# EAGLE board BEP32_12nutzen_90Grad (EAGLE 6.4), part 1 of 8
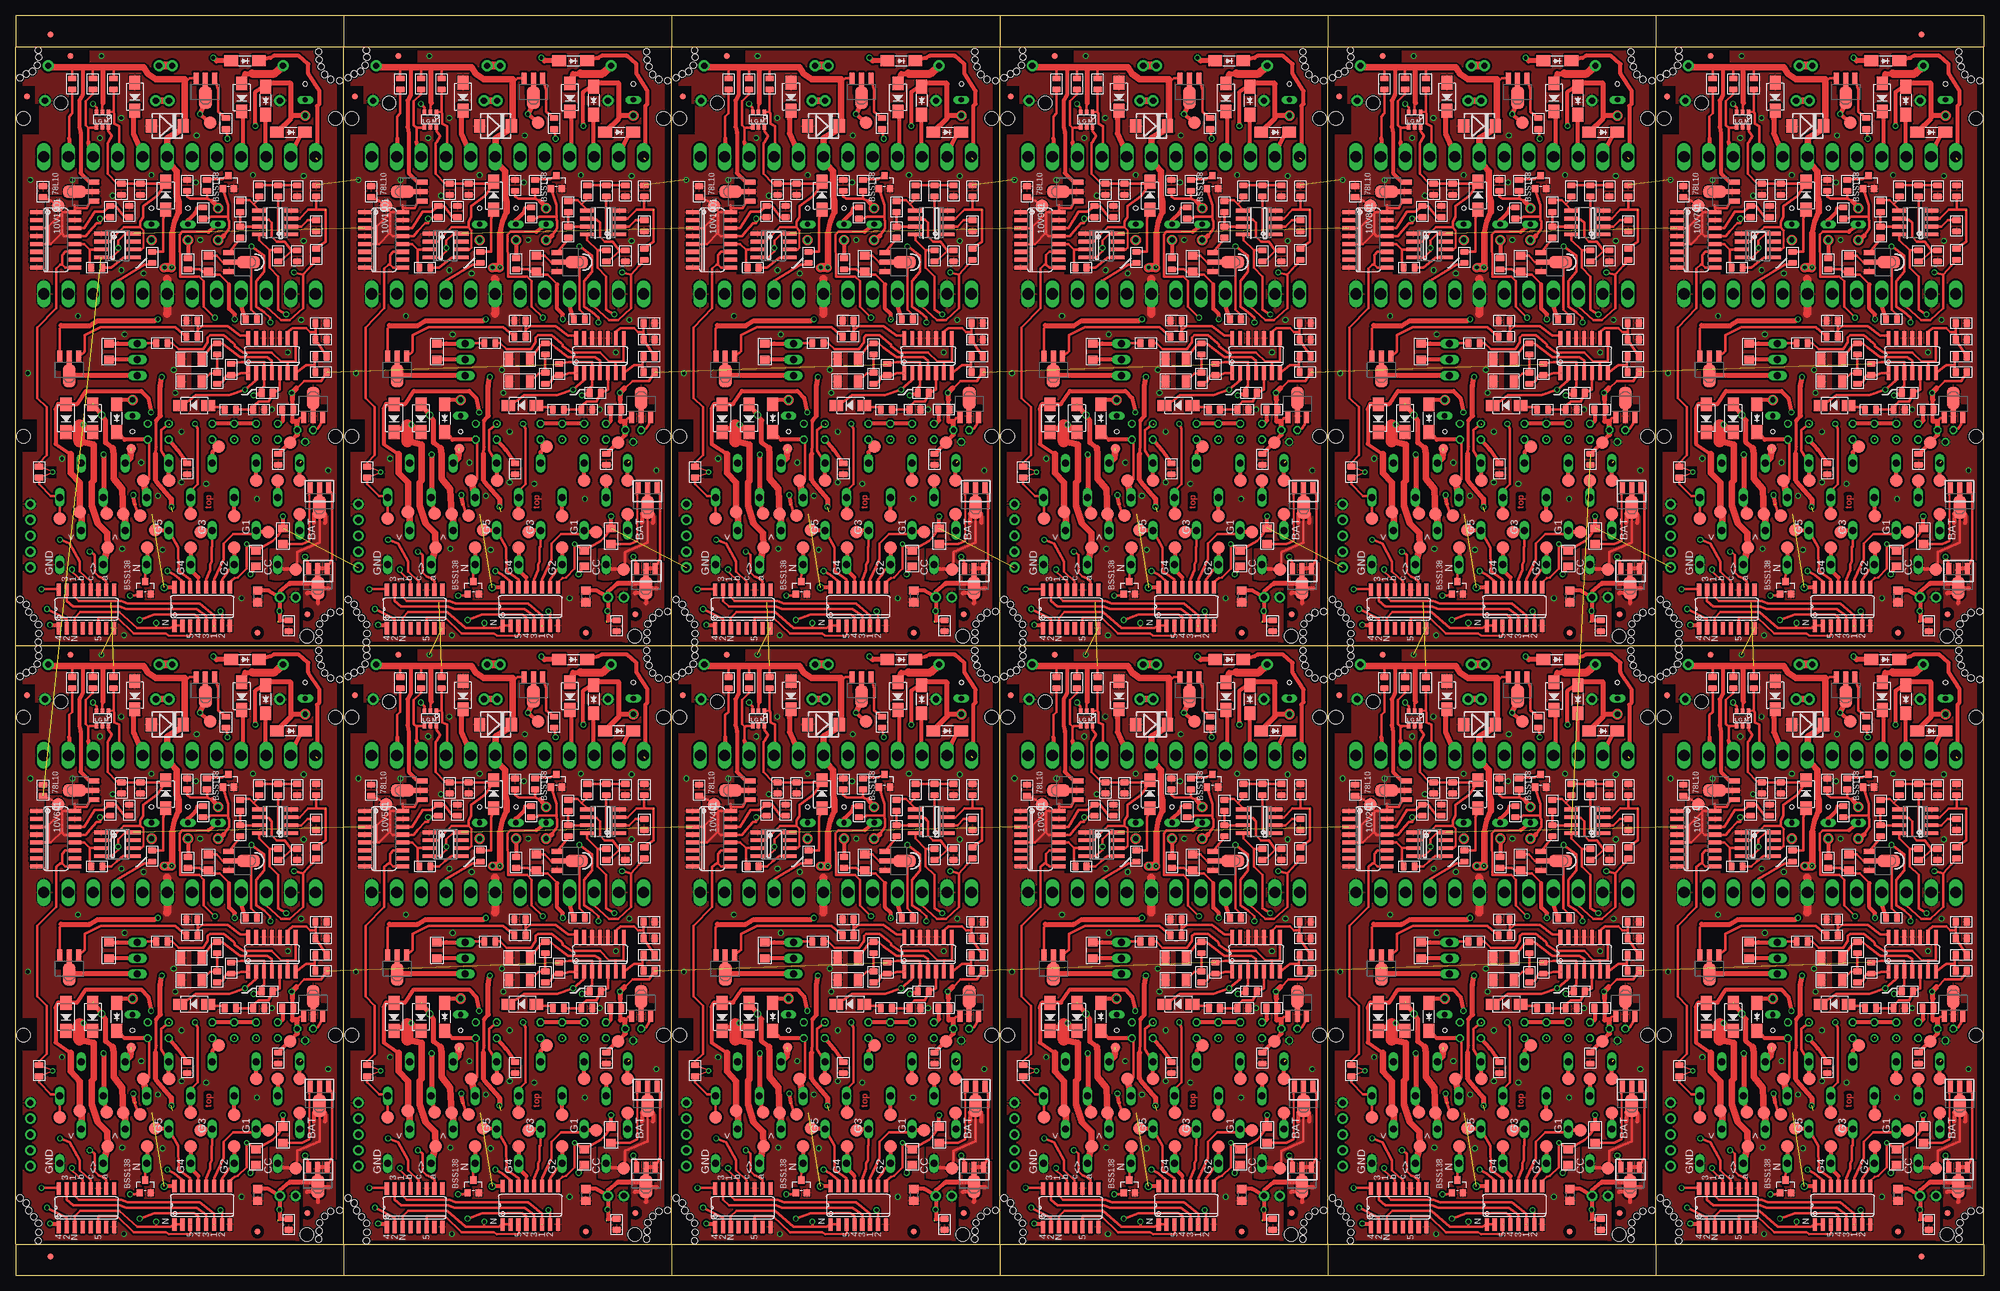
[diagram p24: board, top side]
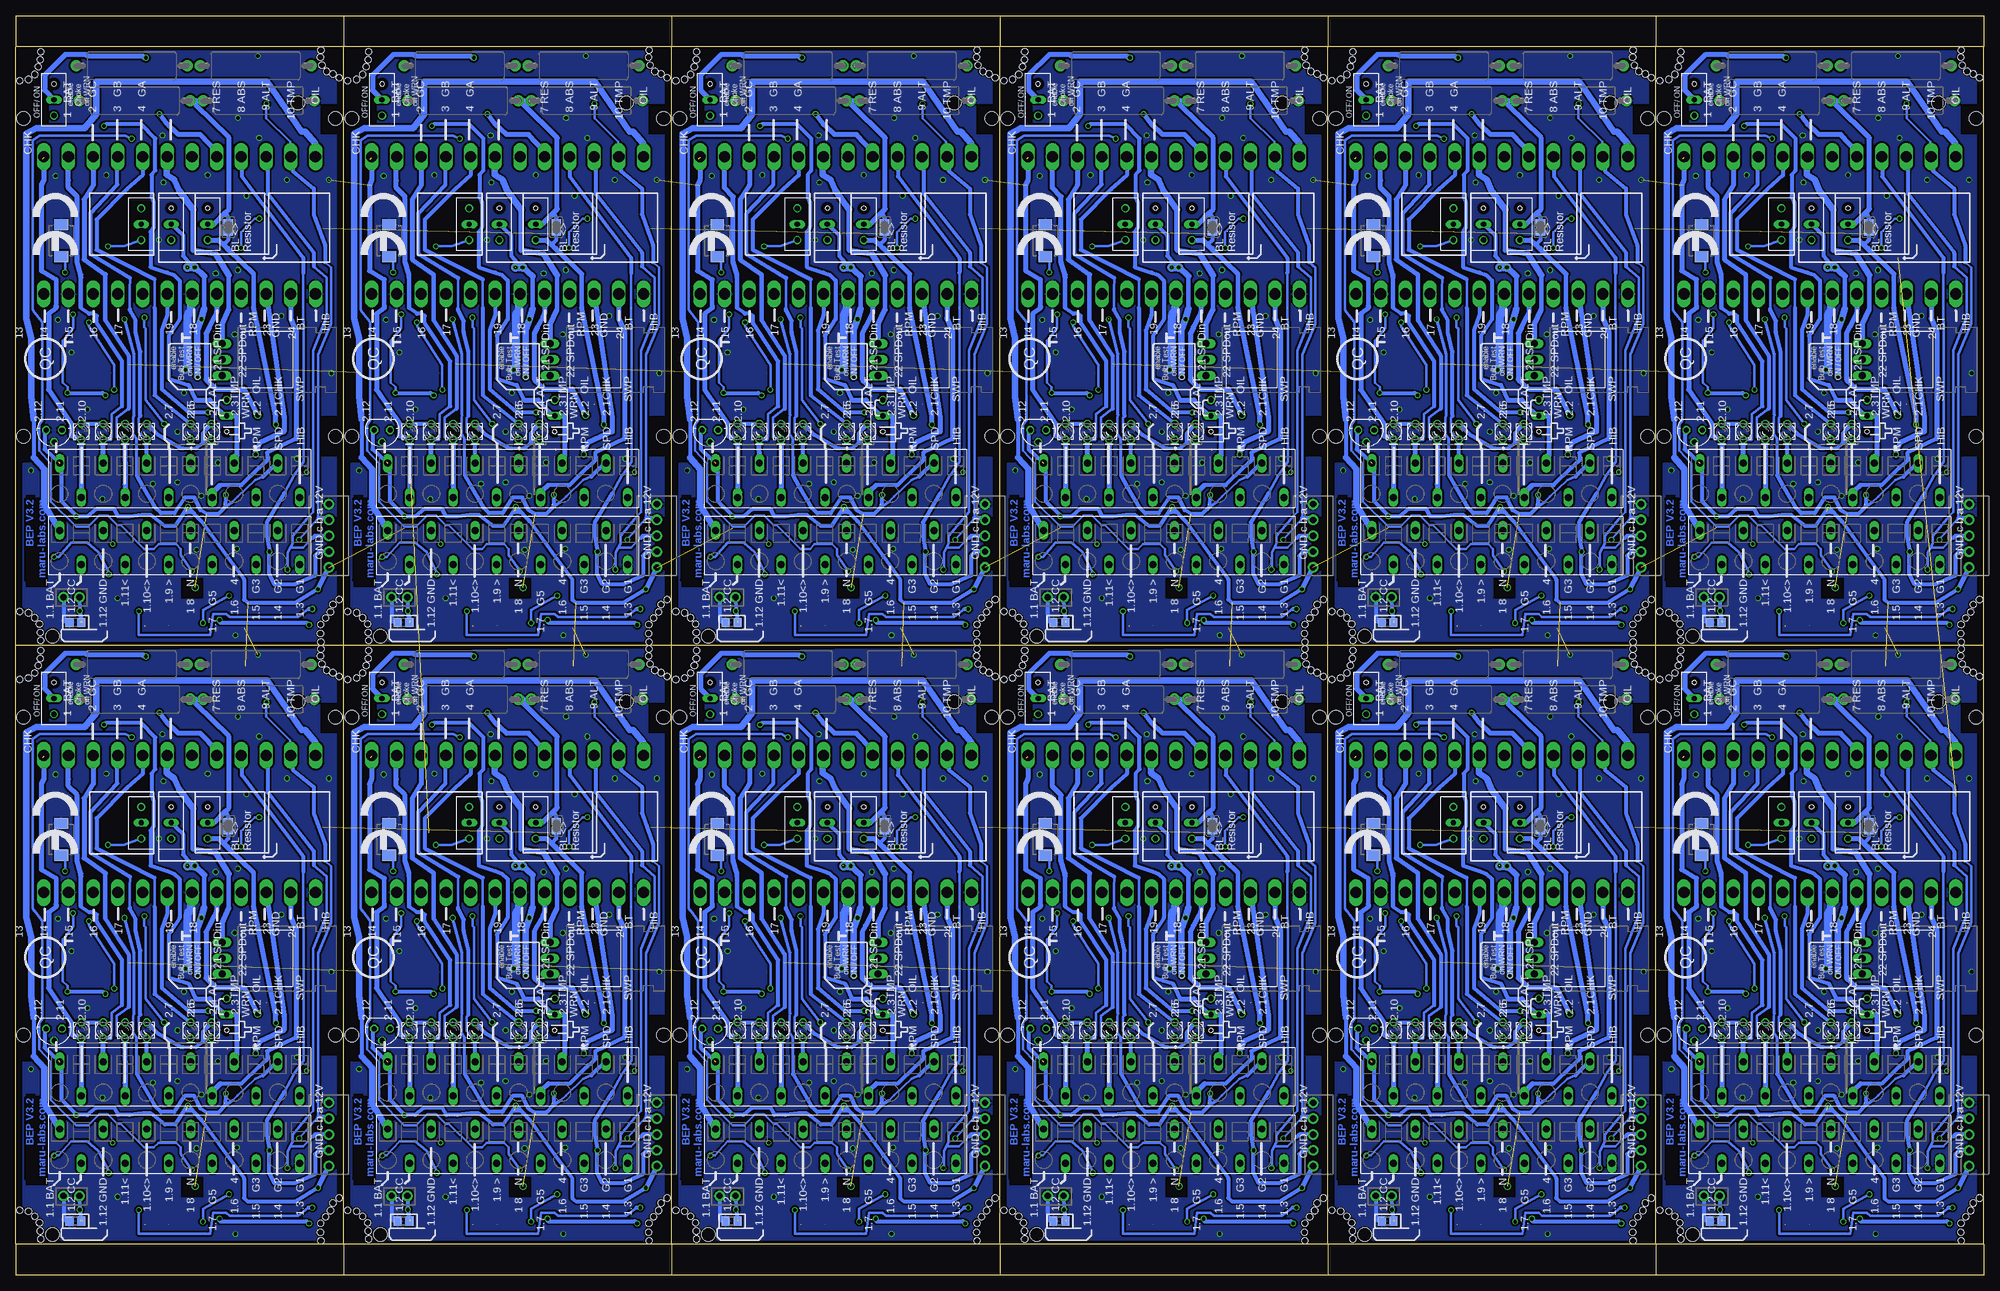
[diagram p25: board, bottom side, seen from below]

Size 315.6 x 202 mm. Coordinates in mm from the lower left corner, seen from the top.
Outline: 58 segments
Copper layers (1*16): Top 0.035mm / dielectric 1.5mm / Bottom 0.035mm
Design rules "multi-cb_035um-cu *": minimum track width 6mil, minimum drill 12mil, track to track 12mil, track to pad 12mil, pad to pad 6mil, via to via 6mil, smd to smd 6mil, copper to edge 10mil, drill to drill 8mil, minimum pad ring 8mil, minimum via ring 6mil, stop-mask expansion 3mil, vias tented up to drill 0mil, thermal gap 8mil
Holes 1.02 mm at 311.59,5.81 311.66,7.08 311.77,8.43 312.55,9.43 313.53,10.24 266.64,100.45 266.73,99.31 266.47,98.04 265.71,97.03 311.59,100.19 311.66,98.92 311.97,97.77 312.55,96.57 313.53,95.76 266.64,5.55 266.73,6.89 266.67,8.36 265.91,9.37 264.71,96.63 263.71,96.03 265.11,10.37 264.71,11.57 263.71,12.37 314.93,10.44 314.93,95.56 258.99,5.81 259.06,7.08 259.17,8.43 259.95,9.43 260.93,10.24 214.04,100.45 214.13,99.31 213.87,98.04 213.11,97.03 258.99,100.19 259.06,98.92 259.37,97.77 259.95,96.57 260.93,95.76 214.04,5.55 214.13,6.89 214.07,8.36 213.31,9.37 212.11,96.63 211.11,96.03 212.51,10.37 212.11,11.57 211.11,12.37 262.33,10.44 262.33,95.56 206.39,5.81 206.46,7.08 206.57,8.43 207.35,9.43 208.33,10.24 161.44,100.45 161.53,99.31 161.27,98.04 160.51,97.03 206.39,100.19 206.46,98.92 206.77,97.77 207.35,96.57 208.33,95.76 161.44,5.55 161.53,6.89 161.47,8.36 160.71,9.37 159.51,96.63 158.51,96.03 159.91,10.37 159.51,11.57 158.51,12.37 209.73,10.44 209.73,95.56 153.79,5.81 153.86,7.08 153.97,8.43 154.75,9.43 155.73,10.24 108.84,100.45 108.93,99.31 108.67,98.04 107.91,97.03 153.79,100.19 153.86,98.92 154.17,97.77 154.75,96.57 155.73,95.76 108.84,5.55 108.93,6.89 108.87,8.36 108.11,9.37 106.91,96.63 105.91,96.03 107.31,10.37 106.91,11.57 105.91,12.37 157.13,10.44 157.13,95.56 101.19,5.81 101.26,7.08 101.37,8.43 102.15,9.43 103.13,10.24 56.24,100.45 56.33,99.31 56.07,98.04 55.31,97.03 101.19,100.19 101.26,98.92 101.57,97.77 102.15,96.57 103.13,95.76 56.24,5.55 56.33,6.89 56.27,8.36 55.51,9.37 54.31,96.63 53.31,96.03 54.71,10.37 54.31,11.57 53.31,12.37 104.53,10.44 104.53,95.56 48.59,5.81 48.66,7.08 48.77,8.43 49.55,9.43 50.53,10.24 3.64,100.45 3.73,99.31 3.47,98.04 2.71,97.03 48.59,100.19 48.66,98.92 48.97,97.77 49.55,96.57 50.53,95.76 3.64,5.55 3.73,6.89 3.67,8.36 2.91,9.37 1.71,96.63 0.71,96.03 2.11,10.37 1.71,11.57 0.71,12.37 51.93,10.44 51.93,95.56 311.59,101.81 311.66,103.08 311.77,104.43 312.55,105.43 313.53,106.24 266.64,196.45 266.73,195.31 266.47,194.04 265.71,193.03 311.59,196.19 311.66,194.92 311.97,193.77 312.55,192.57 313.53,191.76 266.64,101.55 266.73,102.89 266.67,104.36 265.91,105.37 264.71,192.63 263.71,192.03 265.11,106.37 264.71,107.57 263.71,108.37 314.93,106.44 314.93,191.56 258.99,101.81 259.06,103.08 259.17,104.43 259.95,105.43 260.93,106.24 214.04,196.45 214.13,195.31 213.87,194.04 213.11,193.03 258.99,196.19 259.06,194.92 259.37,193.77 259.95,192.57 260.93,191.76 214.04,101.55 214.13,102.89 214.07,104.36 213.31,105.37 212.11,192.63 211.11,192.03 212.51,106.37 212.11,107.57 211.11,108.37 262.33,106.44 262.33,191.56 206.39,101.81 206.46,103.08 206.57,104.43 207.35,105.43 208.33,106.24 161.44,196.45 161.53,195.31 161.27,194.04 160.51,193.03 206.39,196.19 206.46,194.92 206.77,193.77 207.35,192.57 208.33,191.76 161.44,101.55 161.53,102.89 161.47,104.36 160.71,105.37 159.51,192.63 158.51,192.03 159.91,106.37 159.51,107.57 158.51,108.37 209.73,106.44 209.73,191.56 153.79,101.81 153.86,103.08 153.97,104.43 154.75,105.43 155.73,106.24 108.84,196.45 108.93,195.31 108.67,194.04 107.91,193.03 153.79,196.19 153.86,194.92 154.17,193.77 154.75,192.57 155.73,191.76 108.84,101.55 108.93,102.89 108.87,104.36 108.11,105.37 106.91,192.63 105.91,192.03 107.31,106.37 106.91,107.57 105.91,108.37 157.13,106.44 157.13,191.56 101.19,101.81 101.26,103.08 101.37,104.43 102.15,105.43 103.13,106.24 56.24,196.45 56.33,195.31 56.07,194.04 55.31,193.03 101.19,196.19 101.26,194.92 101.57,193.77 102.15,192.57 103.13,191.76 56.24,101.55 56.33,102.89 56.27,104.36 55.51,105.37 54.31,192.63 53.31,192.03 54.71,106.37 54.31,107.57 53.31,108.37 104.53,106.44 104.53,191.56 48.59,101.81 48.66,103.08 48.77,104.43 49.55,105.43 50.53,106.24 3.64,196.45 3.73,195.31 3.47,194.04 2.71,193.03 48.59,196.19 48.66,194.92 48.97,193.77 49.55,192.57 50.53,191.76 3.64,101.55 3.73,102.89 3.67,104.36 2.91,105.37 1.71,192.63 0.71,192.03 2.11,106.37 1.71,107.57 0.71,108.37 51.93,106.44 51.93,191.56
Holes 2.18 mm at 309.7,6.5 270.3,92 257.1,6.5 217.7,92 204.5,6.5 165.1,92 151.9,6.5 112.5,92 99.3,6.5 59.9,92 46.7,6.5 7.3,92 309.7,102.5 270.3,188 257.1,102.5 217.7,188 204.5,102.5 165.1,188 151.9,102.5 112.5,188 99.3,102.5 59.9,188 46.7,102.5 7.3,188
Holes 2.2 mm at 314.3,89.5 314.3,38.5 264.3,38.5 264.3,89.5 261.7,89.5 261.7,38.5 211.7,38.5 211.7,89.5 209.1,89.5 209.1,38.5 159.1,38.5 159.1,89.5 156.5,89.5 156.5,38.5 106.5,38.5 106.5,89.5 103.9,89.5 103.9,38.5 53.9,38.5 53.9,89.5 51.3,89.5 51.3,38.5 1.3,38.5 1.3,89.5 314.3,185.5 314.3,134.5 264.3,134.5 264.3,185.5 261.7,185.5 261.7,134.5 211.7,134.5 211.7,185.5 209.1,185.5 209.1,134.5 159.1,134.5 159.1,185.5 156.5,185.5 156.5,134.5 106.5,134.5 106.5,185.5 103.9,185.5 103.9,134.5 53.9,134.5 53.9,185.5 51.3,185.5 51.3,134.5 1.3,134.5 1.3,185.5
tRestrict: area 291.3,46 to 294.6,52.5; area 268.3,31.8 to 269.6,33.7; area 297,63.4 to 299,65.2; area 269.4,49.1 to 273.7,50.5; area 308.4,42.3 to 312.9,43.6; area 308.5,43.6 to 309.7,46.3; area 309.7,15 to 313.2,16.4; area 273.1,75.3 to 274.4,80; area 292,93.4 to 293.2,95; area 277.4,86.1 to 277.6,87.2; area 272.6,98.5 to 274.8,100.4; area 263.4,91.4 to 266.1,94.7; 168 more areas
bRestrict: area 310.4,14.4 to 314,24.6; area 312.5,24.5 to 314,29.1; area 312.5,34.3 to 314.7,40.8; area 264.1,35.3 to 266.5,41.8; area 310.3,86.6 to 314.1,92.6; area 285.5,12.5 to 289.1,15.8; area 263.7,87 to 266.7,91.8; area 257.8,14.4 to 261.4,24.6; area 259.9,24.5 to 261.4,29.1; area 259.9,34.3 to 262.1,40.8; area 211.5,35.3 to 213.9,41.8; area 257.7,86.6 to 261.5,92.6; 72 more areas

## Footprints (pad centres in the part's own frame; a part is rotated, then mirrored left to right if it is on the bottom)
12-PIN = drill 1.118 long: 1 19.25,-2.45; 2 15.75,3.05; 3 12.25,-2.45; 4 8.75,3.05; 5 5.25,-2.45; 6 1.75,3.05; 7 -1.75,-2.45; 8 -5.25,3.05; 9 -8.75,-2.45; 10 -12.25,3.05; 11 -15.75,-2.45; 12 -19.25,3.05
B2.0 = smd 2 x 2: TP 0,0
C0805 = smd 1.397 x 1.016: 1 0,0.889; 2 0,-0.889
C1206 = smd 1.27 x 2.032: 1 -1.651,0; 2 1.651,0
DO214AA = smd 1.8 x 2.2: A 2.55,0; C -2.55,0
DO-214AC = smd 2.2 x 1.77: 1 -2.242,0; 2 2.242,0
DO214AA_BI = smd 1.8 x 2.2: A 2.45,0; C -2.65,0
DO-214AC_SLIM = smd 2.2 x 1.77: 1 -2.242,0; 2 2.242,0
FIDUCIAL_1MM = smd 1 x 1: 1 0,0
SO08 = smd 0.6 x 2.2: 1 -1.905,-2.6; 2 -0.635,-2.6; 3 0.635,-2.6; 4 1.905,-2.6; 5 1.905,2.6; 6 0.635,2.6; 7 -0.635,2.6; 8 -1.905,2.6
SOT89_ROUND = smd 0.8 x 1.8: 1 -1.499,-2.181; 3 1.499,-2.181 | smd 0.8 x 2.3: 2 0,-1.927 | smd 2.032 x 3.65: 2@1 0,0.94
78LXX = drill 0.813 octagon: GND 0,1.905; IN 1.27,0; OUT -1.27,0
SO16 = smd 0.66 x 2.032: 1 -4.445,-3.073; 2 -3.175,-3.073; 3 -1.905,-3.073; 4 -0.635,-3.073; 5 0.635,-3.073; 6 1.905,-3.073; 7 3.175,-3.073; 8 4.445,-3.073; 9 4.445,3.073; 10 3.175,3.073; 11 1.905,3.073; 12 0.635,3.073; 13 -0.635,3.073; 14 -1.905,3.073; 15 -3.175,3.073; 16 -4.445,3.073
SOT457R_PHILIPS = smd 0.55 x 0.8: 1 -0.95,-1.2; 2 0,-1.2; 3 0.95,-1.2; 4 0.95,1.2; 5 0,1.2; 6 -0.95,1.2
SO14 = smd 0.6 x 2.2: 1 -3.81,-2.8; 2 -2.54,-2.8; 3 -1.27,-2.8; 4 0,-2.8; 5 1.27,-2.8; 6 2.54,-2.8; 7 3.81,-2.8; 8 3.81,2.8; 9 2.54,2.8; 10 1.27,2.8; 11 0,2.8; 12 -1.27,2.8; 13 -2.54,2.8; 14 -3.81,2.8
TO220H_NOHOLE = drill 1.118 long: 1 -2.54,-10.16; 2 0,-10.16; 3 2.54,-10.16
JP2_SMALLPADS = drill 0.85: 1 -2.54,0 | drill 0.85 long: 2 0,0 | hole 0.7: 2.54,0
JP2_ORIG_SMALLPADS = drill 0.85: 1 -2.54,0; 3 2.54,0 | drill 0.85 long: 2 0,0
LD260 = drill 0.813 octagon: A -1.27,0; K 1.27,0
SOT89 = smd 0.8 x 1.8: 1 -1.499,-2.181; 3 1.499,-2.181 | smd 0.8 x 2.3: 2 0,-1.927 | smd 2.032 x 3.65: 2@1 0,0.94
SOT-23 = smd 1.016 x 1.143: 1 -0.889,-1.016; 2 0.889,-1.016; 3 0,1.016
R0805 = smd 1.397 x 1.016: 1 0,0.889; 2 0,-0.889
R1206 = smd 1.27 x 1.524: 1 -1.27,0; 2 1.27,0
R0805' = smd 1.3 x 1.5: 1 -0.95,0; 2 0.95,0
V235/17_1MM = drill 1 pad 1.778: 1 -8.89,0; 2 8.89,0
SJ = smd 1.2 x 1.6: 1 -0.725,0; 2 0.725,0
B1,27 = smd 1.5 x 1.5: TP 0,0
24-PIN_V2 = drill 1.778 long: 1 -21.78,-11; 2 -17.82,-11; 3 -13.86,-11; 4 -9.9,-11; 5 -5.94,-11; 6 -1.98,-11; 7 1.98,-11; 8 5.94,-11; 9 9.9,-11; 10 13.86,-11; 11 17.82,-11; 12 21.78,-11; 13 -21.78,11; 14 -17.82,11; 15 -13.86,11; 16 -9.9,11; 17 -5.94,11; 18 -1.98,11; 19 1.98,11; 20 5.94,11; 21 9.9,11; 22 13.86,11; 23 17.82,11; 24 21.78,11
22-23-2021 = drill 1 pad 1.676: 1 -1.27,0; 2 1.27,0
22-23-2051 = drill 1 pad 1.676: 1 -5.08,0; 2 -2.54,0; 3 0,0; 4 2.54,0; 5 5.08,0

## Placement (x,y rotation side)
1  [12-PIN]  289.3,20.99 180 bottom
2  [12-PIN]  289.3,31.79 180 bottom
3  [12-PIN]  236.7,20.99 180 bottom
4  [12-PIN]  236.7,31.79 180 bottom
5  [12-PIN]  184.1,20.99 180 bottom
6  [12-PIN]  184.1,31.79 180 bottom
6V  TPSB2.0  [B2.0]  307.02,37.5 90 top
6V201  TPSB2.0  [B2.0]  254.42,37.5 90 top
6V301  TPSB2.0  [B2.0]  201.82,37.5 90 top
6V401  TPSB2.0  [B2.0]  149.22,37.5 90 top
6V501  TPSB2.0  [B2.0]  96.62,37.5 90 top
6V601  TPSB2.0  [B2.0]  44.02,37.5 90 top
6V701  TPSB2.0  [B2.0]  307.02,133.5 90 top
6V801  TPSB2.0  [B2.0]  254.42,133.5 90 top
6V901  TPSB2.0  [B2.0]  201.82,133.5 90 top
6V1001  TPSB2.0  [B2.0]  149.22,133.5 90 top
6V1101  TPSB2.0  [B2.0]  96.62,133.5 90 top
6V1201  TPSB2.0  [B2.0]  44.02,133.5 90 top
7  [12-PIN]  131.5,20.99 180 bottom
8  [12-PIN]  131.5,31.79 180 bottom
9  [12-PIN]  78.9,20.99 180 bottom
10  [12-PIN]  78.9,31.79 180 bottom
10V  TPSB2.0  [B2.0]  269.8,75.5 90 top
10V201  TPSB2.0  [B2.0]  217.2,75.5 90 top
10V301  TPSB2.0  [B2.0]  164.6,75.5 90 top
10V401  TPSB2.0  [B2.0]  112,75.5 90 top
10V501  TPSB2.0  [B2.0]  59.4,75.5 90 top
10V601  TPSB2.0  [B2.0]  6.8,75.5 90 top
10V701  TPSB2.0  [B2.0]  269.8,171.5 90 top
10V801  TPSB2.0  [B2.0]  217.2,171.5 90 top
10V901  TPSB2.0  [B2.0]  164.6,171.5 90 top
10V1001  TPSB2.0  [B2.0]  112,171.5 90 top
10V1101  TPSB2.0  [B2.0]  59.4,171.5 90 top
10V1201  TPSB2.0  [B2.0]  6.8,171.5 90 top
11  [12-PIN]  26.3,20.99 180 bottom
12  [12-PIN]  26.3,31.79 180 bottom
13  [12-PIN]  289.3,116.99 180 bottom
14  [12-PIN]  289.3,127.78 180 bottom
15  [12-PIN]  236.7,116.99 180 bottom
16  [12-PIN]  236.7,127.78 180 bottom
17  [12-PIN]  184.1,116.99 180 bottom
18  [12-PIN]  184.1,127.78 180 bottom
19  [12-PIN]  131.5,116.99 180 bottom
20  [12-PIN]  131.5,127.78 180 bottom
21  [12-PIN]  78.9,116.99 180 bottom
22  [12-PIN]  78.9,127.78 180 bottom
23  [12-PIN]  26.3,116.99 180 bottom
24  [12-PIN]  26.3,127.78 180 bottom
C101  4.7u  [C0805]  311.21,77.89 180 top
C102  100nF  [C0805]  267.4,77.76 180 top
C103  100nF,  [C0805]  308.16,77.89 0 top
C104  100nF,  [C0805]  305.12,34.83 0 top
C105  100nF.  [C0805]  311.97,54.01 90 top
C106  100nF.  [C0805]  291.27,57.06 90 top
C107  100u  [C1206]  291.21,47.34 180 top
C108  100u  [C1206]  291.21,50.9 180 top
C109  2.2nF  [C0805]  283.02,78.14 180 top
C110  100nF  [C0805]  281.24,74.58 180 top
C201  4.7u  [C0805]  258.61,77.89 180 top
C202  100nF  [C0805]  214.8,77.76 180 top
C203  100nF,  [C0805]  255.56,77.89 0 top
C204  100nF,  [C0805]  252.52,34.83 0 top
C205  100nF.  [C0805]  259.37,54.01 90 top
C206  100nF.  [C0805]  238.67,57.06 90 top
C207  100u  [C1206]  238.61,47.34 180 top
C208  100u  [C1206]  238.61,50.9 180 top
C209  2.2nF  [C0805]  230.42,78.14 180 top
C210  100nF  [C0805]  228.64,74.58 180 top
C301  4.7u  [C0805]  206.01,77.89 180 top
C302  100nF  [C0805]  162.2,77.76 180 top
C303  100nF,  [C0805]  202.96,77.89 0 top
C304  100nF,  [C0805]  199.92,34.83 0 top
C305  100nF.  [C0805]  206.77,54.01 90 top
C306  100nF.  [C0805]  186.07,57.06 90 top
C307  100u  [C1206]  186.01,47.34 180 top
C308  100u  [C1206]  186.01,50.9 180 top
C309  2.2nF  [C0805]  177.82,78.14 180 top
C310  100nF  [C0805]  176.04,74.58 180 top
C401  4.7u  [C0805]  153.41,77.89 180 top
C402  100nF  [C0805]  109.6,77.76 180 top
C403  100nF,  [C0805]  150.36,77.89 0 top
C404  100nF,  [C0805]  147.32,34.83 0 top
C405  100nF.  [C0805]  154.17,54.01 90 top
C406  100nF.  [C0805]  133.47,57.06 90 top
C407  100u  [C1206]  133.41,47.34 180 top
C408  100u  [C1206]  133.41,50.9 180 top
C409  2.2nF  [C0805]  125.22,78.14 180 top
C410  100nF  [C0805]  123.44,74.58 180 top
C501  4.7u  [C0805]  100.81,77.89 180 top
C502  100nF  [C0805]  57,77.76 180 top
C503  100nF,  [C0805]  97.76,77.89 0 top
C504  100nF,  [C0805]  94.72,34.83 0 top
C505  100nF.  [C0805]  101.57,54.01 90 top
C506  100nF.  [C0805]  80.87,57.06 90 top
C507  100u  [C1206]  80.81,47.34 180 top
C508  100u  [C1206]  80.81,50.9 180 top
C509  2.2nF  [C0805]  72.62,78.14 180 top
C510  100nF  [C0805]  70.84,74.58 180 top
C601  4.7u  [C0805]  48.21,77.89 180 top
C602  100nF  [C0805]  4.4,77.76 180 top
C603  100nF,  [C0805]  45.16,77.89 0 top
C604  100nF,  [C0805]  42.12,34.83 0 top
C605  100nF.  [C0805]  48.97,54.01 90 top
C606  100nF.  [C0805]  28.27,57.06 90 top
C607  100u  [C1206]  28.21,47.34 180 top
C608  100u  [C1206]  28.21,50.9 180 top
C609  2.2nF  [C0805]  20.02,78.14 180 top
C610  100nF  [C0805]  18.24,74.58 180 top
C701  4.7u  [C0805]  311.21,173.89 180 top
C702  100nF  [C0805]  267.4,173.76 180 top
C703  100nF,  [C0805]  308.16,173.89 0 top
C704  100nF,  [C0805]  305.12,130.83 0 top
C705  100nF.  [C0805]  311.97,150.01 90 top
C706  100nF.  [C0805]  291.27,153.06 90 top
C707  100u  [C1206]  291.21,143.34 180 top
C708  100u  [C1206]  291.21,146.9 180 top
C709  2.2nF  [C0805]  283.02,174.14 180 top
C710  100nF  [C0805]  281.24,170.58 180 top
C801  4.7u  [C0805]  258.61,173.89 180 top
C802  100nF  [C0805]  214.8,173.76 180 top
C803  100nF,  [C0805]  255.56,173.89 0 top
C804  100nF,  [C0805]  252.52,130.83 0 top
C805  100nF.  [C0805]  259.37,150.01 90 top
C806  100nF.  [C0805]  238.67,153.06 90 top
C807  100u  [C1206]  238.61,143.34 180 top
C808  100u  [C1206]  238.61,146.9 180 top
C809  2.2nF  [C0805]  230.42,174.14 180 top
C810  100nF  [C0805]  228.64,170.58 180 top
C901  4.7u  [C0805]  206.01,173.89 180 top
C902  100nF  [C0805]  162.2,173.76 180 top
C903  100nF,  [C0805]  202.96,173.89 0 top
C904  100nF,  [C0805]  199.92,130.83 0 top
C905  100nF.  [C0805]  206.77,150.01 90 top
C906  100nF.  [C0805]  186.07,153.06 90 top
C907  100u  [C1206]  186.01,143.34 180 top
C908  100u  [C1206]  186.01,146.9 180 top
C909  2.2nF  [C0805]  177.82,174.14 180 top
C910  100nF  [C0805]  176.04,170.58 180 top
C1001  4.7u  [C0805]  153.41,173.89 180 top
C1002  100nF  [C0805]  109.6,173.76 180 top
C1003  100nF,  [C0805]  150.36,173.89 0 top
C1004  100nF,  [C0805]  147.32,130.83 0 top
C1005  100nF.  [C0805]  154.17,150.01 90 top
C1006  100nF.  [C0805]  133.47,153.06 90 top
C1007  100u  [C1206]  133.41,143.34 180 top
C1008  100u  [C1206]  133.41,146.9 180 top
C1009  2.2nF  [C0805]  125.22,174.14 180 top
C1010  100nF  [C0805]  123.44,170.58 180 top
C1101  4.7u  [C0805]  100.81,173.89 180 top
C1102  100nF  [C0805]  57,173.76 180 top
C1103  100nF,  [C0805]  97.76,173.89 0 top
C1104  100nF,  [C0805]  94.72,130.83 0 top
C1105  100nF.  [C0805]  101.57,150.01 90 top
C1106  100nF.  [C0805]  80.87,153.06 90 top
C1107  100u  [C1206]  80.81,143.34 180 top
C1108  100u  [C1206]  80.81,146.9 180 top
C1109  2.2nF  [C0805]  72.62,174.14 180 top
C1110  100nF  [C0805]  70.84,170.58 180 top
C1201  4.7u  [C0805]  48.21,173.89 180 top
C1202  100nF  [C0805]  4.4,173.76 180 top
C1203  100nF,  [C0805]  45.16,173.89 0 top
C1204  100nF,  [C0805]  42.12,130.83 0 top
C1205  100nF.  [C0805]  48.97,150.01 90 top
C1206  100nF.  [C0805]  28.27,153.06 90 top
C1207  100u  [C1206]  28.21,143.34 180 top
C1208  100u  [C1206]  28.21,146.9 180 top
C1209  2.2nF  [C0805]  20.02,174.14 180 top
C1210  100nF  [C0805]  18.24,170.58 180 top
D101  SM6T  [DO214AA]  287.34,88.3 180 top
D102  1N4007,  [DO-214AC]  275.4,41.44 270 top
D103  1N4007,  [DO-214AC]  271.08,41.44 270 top
D104  SM6TDO214AA_BI  [DO214AA_BI]  308.29,70.01 90 bottom
D105  1N4007.  [DO-214AC]  282.13,93 270 top
D106  1N4007.  [DO-214AC]  299.27,92.87 270 top
D107  1N5817  [DO-214AC_SLIM]  303.08,92.36 270 top
D108  1N5817.  [DO-214AC_SLIM]  307.16,87.3 0 top
D109  1N5817.  [DO-214AC_SLIM]  299.79,98.73 0 top
D110  1N5817  [DO-214AC_SLIM]  279.21,41.44 270 top
D111  1N4007  [DO-214AC]  291.65,43.47 180 top
D112  1N4007  [DO-214AC]  287.08,77.12 90 top
D201  SM6T  [DO214AA]  234.74,88.3 180 top
D202  1N4007,  [DO-214AC]  222.8,41.44 270 top
D203  1N4007,  [DO-214AC]  218.48,41.44 270 top
D204  SM6TDO214AA_BI  [DO214AA_BI]  255.69,70.01 90 bottom
D205  1N4007.  [DO-214AC]  229.53,93 270 top
D206  1N4007.  [DO-214AC]  246.67,92.87 270 top
D207  1N5817  [DO-214AC_SLIM]  250.48,92.36 270 top
D208  1N5817.  [DO-214AC_SLIM]  254.56,87.3 0 top
D209  1N5817.  [DO-214AC_SLIM]  247.19,98.73 0 top
D210  1N5817  [DO-214AC_SLIM]  226.61,41.44 270 top
D211  1N4007  [DO-214AC]  239.05,43.47 180 top
D212  1N4007  [DO-214AC]  234.48,77.12 90 top
D301  SM6T  [DO214AA]  182.14,88.3 180 top
D302  1N4007,  [DO-214AC]  170.2,41.44 270 top
D303  1N4007,  [DO-214AC]  165.88,41.44 270 top
D304  SM6TDO214AA_BI  [DO214AA_BI]  203.09,70.01 90 bottom
D305  1N4007.  [DO-214AC]  176.93,93 270 top
D306  1N4007.  [DO-214AC]  194.07,92.87 270 top
D307  1N5817  [DO-214AC_SLIM]  197.88,92.36 270 top
D308  1N5817.  [DO-214AC_SLIM]  201.96,87.3 0 top
D309  1N5817.  [DO-214AC_SLIM]  194.59,98.73 0 top
D310  1N5817  [DO-214AC_SLIM]  174.01,41.44 270 top
D311  1N4007  [DO-214AC]  186.45,43.47 180 top
D312  1N4007  [DO-214AC]  181.88,77.12 90 top
D401  SM6T  [DO214AA]  129.54,88.3 180 top
D402  1N4007,  [DO-214AC]  117.6,41.44 270 top
D403  1N4007,  [DO-214AC]  113.28,41.44 270 top
D404  SM6TDO214AA_BI  [DO214AA_BI]  150.49,70.01 90 bottom
D405  1N4007.  [DO-214AC]  124.33,93 270 top
D406  1N4007.  [DO-214AC]  141.47,92.87 270 top
D407  1N5817  [DO-214AC_SLIM]  145.28,92.36 270 top
D408  1N5817.  [DO-214AC_SLIM]  149.36,87.3 0 top
D409  1N5817.  [DO-214AC_SLIM]  141.99,98.73 0 top
D410  1N5817  [DO-214AC_SLIM]  121.41,41.44 270 top
D411  1N4007  [DO-214AC]  133.85,43.47 180 top
D412  1N4007  [DO-214AC]  129.28,77.12 90 top
D501  SM6T  [DO214AA]  76.94,88.3 180 top
D502  1N4007,  [DO-214AC]  65,41.44 270 top
D503  1N4007,  [DO-214AC]  60.68,41.44 270 top
D504  SM6TDO214AA_BI  [DO214AA_BI]  97.89,70.01 90 bottom
D505  1N4007.  [DO-214AC]  71.73,93 270 top
D506  1N4007.  [DO-214AC]  88.87,92.87 270 top
D507  1N5817  [DO-214AC_SLIM]  92.68,92.36 270 top
D508  1N5817.  [DO-214AC_SLIM]  96.76,87.3 0 top
D509  1N5817.  [DO-214AC_SLIM]  89.39,98.73 0 top
D510  1N5817  [DO-214AC_SLIM]  68.81,41.44 270 top
D511  1N4007  [DO-214AC]  81.25,43.47 180 top
D512  1N4007  [DO-214AC]  76.68,77.12 90 top
D601  SM6T  [DO214AA]  24.34,88.3 180 top
D602  1N4007,  [DO-214AC]  12.4,41.44 270 top
D603  1N4007,  [DO-214AC]  8.08,41.44 270 top
D604  SM6TDO214AA_BI  [DO214AA_BI]  45.29,70.01 90 bottom
D605  1N4007.  [DO-214AC]  19.13,93 270 top
D606  1N4007.  [DO-214AC]  36.27,92.87 270 top
D607  1N5817  [DO-214AC_SLIM]  40.08,92.36 270 top
D608  1N5817.  [DO-214AC_SLIM]  44.16,87.3 0 top
D609  1N5817.  [DO-214AC_SLIM]  36.79,98.73 0 top
D610  1N5817  [DO-214AC_SLIM]  16.21,41.44 270 top
D611  1N4007  [DO-214AC]  28.65,43.47 180 top
D612  1N4007  [DO-214AC]  24.08,77.12 90 top
D701  SM6T  [DO214AA]  287.34,184.3 180 top
D702  1N4007,  [DO-214AC]  275.4,137.44 270 top
D703  1N4007,  [DO-214AC]  271.08,137.44 270 top
D704  SM6TDO214AA_BI  [DO214AA_BI]  308.29,166.01 90 bottom
D705  1N4007.  [DO-214AC]  282.13,189 270 top
D706  1N4007.  [DO-214AC]  299.27,188.87 270 top
D707  1N5817  [DO-214AC_SLIM]  303.08,188.36 270 top
D708  1N5817.  [DO-214AC_SLIM]  307.16,183.3 0 top
D709  1N5817.  [DO-214AC_SLIM]  299.79,194.73 0 top
D710  1N5817  [DO-214AC_SLIM]  279.21,137.44 270 top
D711  1N4007  [DO-214AC]  291.65,139.47 180 top
D712  1N4007  [DO-214AC]  287.08,173.12 90 top
D801  SM6T  [DO214AA]  234.74,184.3 180 top
D802  1N4007,  [DO-214AC]  222.8,137.44 270 top
D803  1N4007,  [DO-214AC]  218.48,137.44 270 top
D804  SM6TDO214AA_BI  [DO214AA_BI]  255.69,166.01 90 bottom
D805  1N4007.  [DO-214AC]  229.53,189 270 top
D806  1N4007.  [DO-214AC]  246.67,188.87 270 top
D807  1N5817  [DO-214AC_SLIM]  250.48,188.36 270 top
D808  1N5817.  [DO-214AC_SLIM]  254.56,183.3 0 top
D809  1N5817.  [DO-214AC_SLIM]  247.19,194.73 0 top
D810  1N5817  [DO-214AC_SLIM]  226.61,137.44 270 top
D811  1N4007  [DO-214AC]  239.05,139.47 180 top
D812  1N4007  [DO-214AC]  234.48,173.12 90 top
D901  SM6T  [DO214AA]  182.14,184.3 180 top
D902  1N4007,  [DO-214AC]  170.2,137.44 270 top
D903  1N4007,  [DO-214AC]  165.88,137.44 270 top
D904  SM6TDO214AA_BI  [DO214AA_BI]  203.09,166.01 90 bottom
D905  1N4007.  [DO-214AC]  176.93,189 270 top
D906  1N4007.  [DO-214AC]  194.07,188.87 270 top
D907  1N5817  [DO-214AC_SLIM]  197.88,188.36 270 top
D908  1N5817.  [DO-214AC_SLIM]  201.96,183.3 0 top
D909  1N5817.  [DO-214AC_SLIM]  194.59,194.73 0 top
D910  1N5817  [DO-214AC_SLIM]  174.01,137.44 270 top
D911  1N4007  [DO-214AC]  186.45,139.47 180 top
D912  1N4007  [DO-214AC]  181.88,173.12 90 top
D1001  SM6T  [DO214AA]  129.54,184.3 180 top
D1002  1N4007,  [DO-214AC]  117.6,137.44 270 top
D1003  1N4007,  [DO-214AC]  113.28,137.44 270 top
D1004  SM6TDO214AA_BI  [DO214AA_BI]  150.49,166.01 90 bottom
D1005  1N4007.  [DO-214AC]  124.33,189 270 top
D1006  1N4007.  [DO-214AC]  141.47,188.87 270 top
D1007  1N5817  [DO-214AC_SLIM]  145.28,188.36 270 top
D1008  1N5817.  [DO-214AC_SLIM]  149.36,183.3 0 top
D1009  1N5817.  [DO-214AC_SLIM]  141.99,194.73 0 top
D1010  1N5817  [DO-214AC_SLIM]  121.41,137.44 270 top
D1011  1N4007  [DO-214AC]  133.85,139.47 180 top
D1012  1N4007  [DO-214AC]  129.28,173.12 90 top
D1101  SM6T  [DO214AA]  76.94,184.3 180 top
D1102  1N4007,  [DO-214AC]  65,137.44 270 top
D1103  1N4007,  [DO-214AC]  60.68,137.44 270 top
D1104  SM6TDO214AA_BI  [DO214AA_BI]  97.89,166.01 90 bottom
D1105  1N4007.  [DO-214AC]  71.73,189 270 top
D1106  1N4007.  [DO-214AC]  88.87,188.87 270 top
D1107  1N5817  [DO-214AC_SLIM]  92.68,188.36 270 top
D1108  1N5817.  [DO-214AC_SLIM]  96.76,183.3 0 top
D1109  1N5817.  [DO-214AC_SLIM]  89.39,194.73 0 top
D1110  1N5817  [DO-214AC_SLIM]  68.81,137.44 270 top
D1111  1N4007  [DO-214AC]  81.25,139.47 180 top
D1112  1N4007  [DO-214AC]  76.68,173.12 90 top
D1201  SM6T  [DO214AA]  24.34,184.3 180 top
D1202  1N4007,  [DO-214AC]  12.4,137.44 270 top
D1203  1N4007,  [DO-214AC]  8.08,137.44 270 top
D1204  SM6TDO214AA_BI  [DO214AA_BI]  45.29,166.01 90 bottom
D1205  1N4007.  [DO-214AC]  19.13,189 270 top
D1206  1N4007.  [DO-214AC]  36.27,188.87 270 top
D1207  1N5817  [DO-214AC_SLIM]  40.08,188.36 270 top
D1208  1N5817.  [DO-214AC_SLIM]  44.16,183.3 0 top
D1209  1N5817.  [DO-214AC_SLIM]  36.79,194.73 0 top
D1210  1N5817  [DO-214AC_SLIM]  16.21,137.44 270 top
D1211  1N4007  [DO-214AC]  28.65,139.47 180 top
D1212  1N4007  [DO-214AC]  24.08,173.12 90 top
FID1  FIDUCIAL  [FIDUCIAL_1MM]  305.6,199 90 top
FID2  FIDUCIAL  [FIDUCIAL_1MM]  5.6,3 90 top
FID101  FIDUCIAL  [FIDUCIAL_1MM]  264.8,93 90 top
FID102  FIDUCIAL  [FIDUCIAL_1MM]  301.8,7 90 top
FID103  FIDUCIAL  [FIDUCIAL_1MM]  309.8,10 90 top
FID104  FIDUCIAL  [FIDUCIAL_1MM]  271.8,99.5 90 top
FID105  FIDUCIAL  [FIDUCIAL_1MM]  305.6,3 90 top
FID108  FIDUCIAL  [FIDUCIAL_1MM]  5.6,199 90 top
FID201  FIDUCIAL  [FIDUCIAL_1MM]  212.2,93 90 top
FID202  FIDUCIAL  [FIDUCIAL_1MM]  249.2,7 90 top
FID203  FIDUCIAL  [FIDUCIAL_1MM]  257.2,10 90 top
FID204  FIDUCIAL  [FIDUCIAL_1MM]  219.2,99.5 90 top
FID301  FIDUCIAL  [FIDUCIAL_1MM]  159.6,93 90 top
FID302  FIDUCIAL  [FIDUCIAL_1MM]  196.6,7 90 top
FID303  FIDUCIAL  [FIDUCIAL_1MM]  204.6,10 90 top
FID304  FIDUCIAL  [FIDUCIAL_1MM]  166.6,99.5 90 top
FID401  FIDUCIAL  [FIDUCIAL_1MM]  107,93 90 top
FID402  FIDUCIAL  [FIDUCIAL_1MM]  144,7 90 top
FID403  FIDUCIAL  [FIDUCIAL_1MM]  152,10 90 top
FID404  FIDUCIAL  [FIDUCIAL_1MM]  114,99.5 90 top
FID501  FIDUCIAL  [FIDUCIAL_1MM]  54.4,93 90 top
FID502  FIDUCIAL  [FIDUCIAL_1MM]  91.4,7 90 top
FID503  FIDUCIAL  [FIDUCIAL_1MM]  99.4,10 90 top
FID504  FIDUCIAL  [FIDUCIAL_1MM]  61.4,99.5 90 top
FID601  FIDUCIAL  [FIDUCIAL_1MM]  1.8,93 90 top
FID602  FIDUCIAL  [FIDUCIAL_1MM]  38.8,7 90 top
FID603  FIDUCIAL  [FIDUCIAL_1MM]  46.8,10 90 top
FID604  FIDUCIAL  [FIDUCIAL_1MM]  8.8,99.5 90 top
FID701  FIDUCIAL  [FIDUCIAL_1MM]  264.8,189 90 top
FID702  FIDUCIAL  [FIDUCIAL_1MM]  301.8,103 90 top
FID703  FIDUCIAL  [FIDUCIAL_1MM]  309.8,106 90 top
FID704  FIDUCIAL  [FIDUCIAL_1MM]  271.8,195.5 90 top
FID801  FIDUCIAL  [FIDUCIAL_1MM]  212.2,189 90 top
FID802  FIDUCIAL  [FIDUCIAL_1MM]  249.2,103 90 top
FID803  FIDUCIAL  [FIDUCIAL_1MM]  257.2,106 90 top
FID804  FIDUCIAL  [FIDUCIAL_1MM]  219.2,195.5 90 top
FID901  FIDUCIAL  [FIDUCIAL_1MM]  159.6,189 90 top
FID902  FIDUCIAL  [FIDUCIAL_1MM]  196.6,103 90 top
FID903  FIDUCIAL  [FIDUCIAL_1MM]  204.6,106 90 top
FID904  FIDUCIAL  [FIDUCIAL_1MM]  166.6,195.5 90 top
FID1001  FIDUCIAL  [FIDUCIAL_1MM]  107,189 90 top
FID1002  FIDUCIAL  [FIDUCIAL_1MM]  144,103 90 top
FID1003  FIDUCIAL  [FIDUCIAL_1MM]  152,106 90 top
FID1004  FIDUCIAL  [FIDUCIAL_1MM]  114,195.5 90 top
FID1101  FIDUCIAL  [FIDUCIAL_1MM]  54.4,189 90 top
FID1102  FIDUCIAL  [FIDUCIAL_1MM]  91.4,103 90 top
FID1103  FIDUCIAL  [FIDUCIAL_1MM]  99.4,106 90 top
FID1104  FIDUCIAL  [FIDUCIAL_1MM]  61.4,195.5 90 top
FID1201  FIDUCIAL  [FIDUCIAL_1MM]  1.8,189 90 top
FID1202  FIDUCIAL  [FIDUCIAL_1MM]  38.8,103 90 top
FID1203  FIDUCIAL  [FIDUCIAL_1MM]  46.8,106 90 top
FID1204  FIDUCIAL  [FIDUCIAL_1MM]  8.8,195.5 90 top
IC101  LM2904  [SO08]  304.61,72.81 90 top
IC102  78L06  [SOT89_ROUND]  310.7,43.72 0 top
IC103  6V pos  [78LXX]  309.43,39.53 180 bottom
IC104  78L10  [SOT89_ROUND]  273.37,77.76 90 top
IC105  4028  [SO16]  274.38,10.83 0 top
IC106  NUP4304SOT457_R  [SOT457R_PHILIPS]  276.92,89.32 180 top
IC107  ULN2004  [SO16]  292.92,11.23 0 top
IC108  LM339  [SO14]  304.1,51.47 0 top
IC109  317TO202H_NOHOLE  [TO220H_NOHOLE]  272.35,50.84 270 bottom
IC110  555  [SO08]  279.33,69.12 270 top
IC111  4538  [SO16]  269.43,70.01 270 top
IC201  LM2904  [SO08]  252.01,72.81 90 top
IC202  78L06  [SOT89_ROUND]  258.1,43.72 0 top
IC203  6V pos  [78LXX]  256.83,39.53 180 bottom
IC204  78L10  [SOT89_ROUND]  220.77,77.76 90 top
IC205  4028  [SO16]  221.78,10.83 0 top
IC206  NUP4304SOT457_R  [SOT457R_PHILIPS]  224.32,89.32 180 top
IC207  ULN2004  [SO16]  240.32,11.23 0 top
IC208  LM339  [SO14]  251.5,51.47 0 top
IC209  317TO202H_NOHOLE  [TO220H_NOHOLE]  219.75,50.84 270 bottom
IC210  555  [SO08]  226.74,69.12 270 top
IC211  4538  [SO16]  216.83,70.01 270 top
IC301  LM2904  [SO08]  199.41,72.81 90 top
IC302  78L06  [SOT89_ROUND]  205.5,43.72 0 top
IC303  6V pos  [78LXX]  204.23,39.53 180 bottom
IC304  78L10  [SOT89_ROUND]  168.17,77.76 90 top
IC305  4028  [SO16]  169.18,10.83 0 top
IC306  NUP4304SOT457_R  [SOT457R_PHILIPS]  171.72,89.32 180 top
IC307  ULN2004  [SO16]  187.72,11.23 0 top
IC308  LM339  [SO14]  198.9,51.47 0 top
IC309  317TO202H_NOHOLE  [TO220H_NOHOLE]  167.15,50.84 270 bottom
IC310  555  [SO08]  174.13,69.12 270 top
IC311  4538  [SO16]  164.23,70.01 270 top
IC401  LM2904  [SO08]  146.81,72.81 90 top
IC402  78L06  [SOT89_ROUND]  152.9,43.72 0 top
IC403  6V pos  [78LXX]  151.63,39.53 180 bottom
IC404  78L10  [SOT89_ROUND]  115.57,77.76 90 top
IC405  4028  [SO16]  116.58,10.83 0 top
IC406  NUP4304SOT457_R  [SOT457R_PHILIPS]  119.12,89.32 180 top
IC407  ULN2004  [SO16]  135.12,11.23 0 top
IC408  LM339  [SO14]  146.3,51.47 0 top
IC409  317TO202H_NOHOLE  [TO220H_NOHOLE]  114.55,50.84 270 bottom
IC410  555  [SO08]  121.53,69.12 270 top
IC411  4538  [SO16]  111.63,70.01 270 top
IC501  LM2904  [SO08]  94.21,72.81 90 top
IC502  78L06  [SOT89_ROUND]  100.3,43.72 0 top
IC503  6V pos  [78LXX]  99.03,39.53 180 bottom
IC504  78L10  [SOT89_ROUND]  62.97,77.76 90 top
IC505  4028  [SO16]  63.98,10.83 0 top
IC506  NUP4304SOT457_R  [SOT457R_PHILIPS]  66.52,89.32 180 top
IC507  ULN2004  [SO16]  82.52,11.23 0 top
IC508  LM339  [SO14]  93.7,51.47 0 top
IC509  317TO202H_NOHOLE  [TO220H_NOHOLE]  61.95,50.84 270 bottom
IC510  555  [SO08]  68.94,69.12 270 top
IC511  4538  [SO16]  59.03,70.01 270 top
IC601  LM2904  [SO08]  41.61,72.81 90 top
IC602  78L06  [SOT89_ROUND]  47.7,43.72 0 top
IC603  6V pos  [78LXX]  46.43,39.53 180 bottom
IC604  78L10  [SOT89_ROUND]  10.37,77.76 90 top
IC605  4028  [SO16]  11.38,10.83 0 top
IC606  NUP4304SOT457_R  [SOT457R_PHILIPS]  13.92,89.32 180 top
IC607  ULN2004  [SO16]  29.92,11.23 0 top
IC608  LM339  [SO14]  41.1,51.47 0 top
IC609  317TO202H_NOHOLE  [TO220H_NOHOLE]  9.35,50.84 270 bottom
IC610  555  [SO08]  16.34,69.12 270 top
IC611  4538  [SO16]  6.43,70.01 270 top
IC701  LM2904  [SO08]  304.61,168.81 90 top
IC702  78L06  [SOT89_ROUND]  310.7,139.72 0 top
IC703  6V pos  [78LXX]  309.43,135.53 180 bottom
IC704  78L10  [SOT89_ROUND]  273.37,173.76 90 top
IC705  4028  [SO16]  274.38,106.83 0 top
IC706  NUP4304SOT457_R  [SOT457R_PHILIPS]  276.92,185.32 180 top
IC707  ULN2004  [SO16]  292.92,107.23 0 top
IC708  LM339  [SO14]  304.1,147.47 0 top
IC709  317TO202H_NOHOLE  [TO220H_NOHOLE]  272.35,146.84 270 bottom
IC710  555  [SO08]  279.33,165.12 270 top
IC711  4538  [SO16]  269.43,166.01 270 top
IC801  LM2904  [SO08]  252.01,168.81 90 top
IC802  78L06  [SOT89_ROUND]  258.1,139.72 0 top
IC803  6V pos  [78LXX]  256.83,135.53 180 bottom
IC804  78L10  [SOT89_ROUND]  220.77,173.76 90 top
IC805  4028  [SO16]  221.78,106.83 0 top
IC806  NUP4304SOT457_R  [SOT457R_PHILIPS]  224.32,185.32 180 top
IC807  ULN2004  [SO16]  240.32,107.23 0 top
IC808  LM339  [SO14]  251.5,147.47 0 top
IC809  317TO202H_NOHOLE  [TO220H_NOHOLE]  219.75,146.84 270 bottom
IC810  555  [SO08]  226.74,165.12 270 top
IC811  4538  [SO16]  216.83,166.01 270 top
IC901  LM2904  [SO08]  199.41,168.81 90 top
IC902  78L06  [SOT89_ROUND]  205.5,139.72 0 top
IC903  6V pos  [78LXX]  204.23,135.53 180 bottom
IC904  78L10  [SOT89_ROUND]  168.17,173.76 90 top
IC905  4028  [SO16]  169.18,106.83 0 top
IC906  NUP4304SOT457_R  [SOT457R_PHILIPS]  171.72,185.32 180 top
IC907  ULN2004  [SO16]  187.72,107.23 0 top
IC908  LM339  [SO14]  198.9,147.47 0 top
IC909  317TO202H_NOHOLE  [TO220H_NOHOLE]  167.15,146.84 270 bottom
IC910  555  [SO08]  174.13,165.12 270 top
IC911  4538  [SO16]  164.23,166.01 270 top
IC1001  LM2904  [SO08]  146.81,168.81 90 top
IC1002  78L06  [SOT89_ROUND]  152.9,139.72 0 top
IC1003  6V pos  [78LXX]  151.63,135.53 180 bottom
IC1004  78L10  [SOT89_ROUND]  115.57,173.76 90 top
IC1005  4028  [SO16]  116.58,106.83 0 top
IC1006  NUP4304SOT457_R  [SOT457R_PHILIPS]  119.12,185.32 180 top
IC1007  ULN2004  [SO16]  135.12,107.23 0 top
IC1008  LM339  [SO14]  146.3,147.47 0 top
IC1009  317TO202H_NOHOLE  [TO220H_NOHOLE]  114.55,146.84 270 bottom
IC1010  555  [SO08]  121.53,165.12 270 top
IC1011  4538  [SO16]  111.63,166.01 270 top
IC1101  LM2904  [SO08]  94.21,168.81 90 top
IC1102  78L06  [SOT89_ROUND]  100.3,139.72 0 top
IC1103  6V pos  [78LXX]  99.03,135.53 180 bottom
IC1104  78L10  [SOT89_ROUND]  62.97,173.76 90 top
IC1105  4028  [SO16]  63.98,106.83 0 top
IC1106  NUP4304SOT457_R  [SOT457R_PHILIPS]  66.52,185.32 180 top
IC1107  ULN2004  [SO16]  82.52,107.23 0 top
IC1108  LM339  [SO14]  93.7,147.47 0 top
IC1109  317TO202H_NOHOLE  [TO220H_NOHOLE]  61.95,146.84 270 bottom
IC1110  555  [SO08]  68.94,165.12 270 top
IC1111  4538  [SO16]  59.03,166.01 270 top
IC1201  LM2904  [SO08]  41.61,168.81 90 top
IC1202  78L06  [SOT89_ROUND]  47.7,139.72 0 top
IC1203  6V pos  [78LXX]  46.43,135.53 180 bottom
IC1204  78L10  [SOT89_ROUND]  10.37,173.76 90 top
IC1205  4028  [SO16]  11.38,106.83 0 top
IC1206  NUP4304SOT457_R  [SOT457R_PHILIPS]  13.92,185.32 180 top
IC1207  ULN2004  [SO16]  29.92,107.23 0 top
IC1208  LM339  [SO14]  41.1,147.47 0 top
IC1209  317TO202H_NOHOLE  [TO220H_NOHOLE]  9.35,146.84 270 bottom
IC1210  555  [SO08]  16.34,165.12 270 top
IC1211  4538  [SO16]  6.43,166.01 270 top
JP101  [JP2_SMALLPADS]  290.64,72.55 90 bottom
JP102  [JP2_SMALLPADS]  309.45,92.5 90 bottom
JP103  [JP2_SMALLPADS]  281.75,41.82 270 bottom
JP104  [JP2_SMALLPADS]  284.8,72.55 90 bottom
JP105  JP2E_ORIG  [JP2_ORIG_SMALLPADS]  295.46,72.55 90 bottom
JP201  [JP2_SMALLPADS]  238.04,72.55 90 bottom
JP202  [JP2_SMALLPADS]  256.85,92.5 90 bottom
JP203  [JP2_SMALLPADS]  229.15,41.82 270 bottom
JP204  [JP2_SMALLPADS]  232.2,72.55 90 bottom
JP205  JP2E_ORIG  [JP2_ORIG_SMALLPADS]  242.86,72.55 90 bottom
JP301  [JP2_SMALLPADS]  185.44,72.55 90 bottom
JP302  [JP2_SMALLPADS]  204.25,92.5 90 bottom
JP303  [JP2_SMALLPADS]  176.55,41.82 270 bottom
JP304  [JP2_SMALLPADS]  179.6,72.55 90 bottom
JP305  JP2E_ORIG  [JP2_ORIG_SMALLPADS]  190.26,72.55 90 bottom
JP401  [JP2_SMALLPADS]  132.84,72.55 90 bottom
JP402  [JP2_SMALLPADS]  151.65,92.5 90 bottom
JP403  [JP2_SMALLPADS]  123.95,41.82 270 bottom
JP404  [JP2_SMALLPADS]  127,72.55 90 bottom
JP405  JP2E_ORIG  [JP2_ORIG_SMALLPADS]  137.66,72.55 90 bottom
JP501  [JP2_SMALLPADS]  80.24,72.55 90 bottom
JP502  [JP2_SMALLPADS]  99.05,92.5 90 bottom
JP503  [JP2_SMALLPADS]  71.35,41.82 270 bottom
JP504  [JP2_SMALLPADS]  74.4,72.55 90 bottom
JP505  JP2E_ORIG  [JP2_ORIG_SMALLPADS]  85.06,72.55 90 bottom
JP601  [JP2_SMALLPADS]  27.64,72.55 90 bottom
JP602  [JP2_SMALLPADS]  46.45,92.5 90 bottom
JP603  [JP2_SMALLPADS]  18.75,41.82 270 bottom
JP604  [JP2_SMALLPADS]  21.8,72.55 90 bottom
JP605  JP2E_ORIG  [JP2_ORIG_SMALLPADS]  32.46,72.55 90 bottom
JP701  [JP2_SMALLPADS]  290.64,168.55 90 bottom
JP702  [JP2_SMALLPADS]  309.45,188.5 90 bottom
JP703  [JP2_SMALLPADS]  281.75,137.82 270 bottom
JP704  [JP2_SMALLPADS]  284.8,168.55 90 bottom
JP705  JP2E_ORIG  [JP2_ORIG_SMALLPADS]  295.46,168.55 90 bottom
JP801  [JP2_SMALLPADS]  238.04,168.55 90 bottom
JP802  [JP2_SMALLPADS]  256.85,188.5 90 bottom
JP803  [JP2_SMALLPADS]  229.15,137.82 270 bottom
JP804  [JP2_SMALLPADS]  232.2,168.55 90 bottom
JP805  JP2E_ORIG  [JP2_ORIG_SMALLPADS]  242.86,168.55 90 bottom
JP901  [JP2_SMALLPADS]  185.44,168.55 90 bottom
JP902  [JP2_SMALLPADS]  204.25,188.5 90 bottom
JP903  [JP2_SMALLPADS]  176.55,137.82 270 bottom
JP904  [JP2_SMALLPADS]  179.6,168.55 90 bottom
JP905  JP2E_ORIG  [JP2_ORIG_SMALLPADS]  190.26,168.55 90 bottom
JP1001  [JP2_SMALLPADS]  132.84,168.55 90 bottom
JP1002  [JP2_SMALLPADS]  151.65,188.5 90 bottom
JP1003  [JP2_SMALLPADS]  123.95,137.82 270 bottom
JP1004  [JP2_SMALLPADS]  127,168.55 90 bottom
JP1005  JP2E_ORIG  [JP2_ORIG_SMALLPADS]  137.66,168.55 90 bottom
JP1101  [JP2_SMALLPADS]  80.24,168.55 90 bottom
JP1102  [JP2_SMALLPADS]  99.05,188.5 90 bottom
JP1103  [JP2_SMALLPADS]  71.35,137.82 270 bottom
JP1104  [JP2_SMALLPADS]  74.4,168.55 90 bottom
JP1105  JP2E_ORIG  [JP2_ORIG_SMALLPADS]  85.06,168.55 90 bottom
JP1201  [JP2_SMALLPADS]  27.64,168.55 90 bottom
JP1202  [JP2_SMALLPADS]  46.45,188.5 90 bottom
JP1203  [JP2_SMALLPADS]  18.75,137.82 270 bottom
JP1204  [JP2_SMALLPADS]  21.8,168.55 90 bottom
JP1205  JP2E_ORIG  [JP2_ORIG_SMALLPADS]  32.46,168.55 90 bottom
LED101  [LD260]  287.55,39.28 270 bottom
LED102  [LD260]  305.05,39.28 270 bottom
LED103  [LD260]  301.55,39.28 270 bottom
LED104  [LD260]  298.05,39.28 270 bottom
LED105  [LD260]  294.55,39.28 270 bottom
LED106  [LD260]  284.18,39.28 270 bottom
LED201  [LD260]  234.95,39.28 270 bottom
LED202  [LD260]  252.45,39.28 270 bottom
LED203  [LD260]  248.95,39.28 270 bottom
LED204  [LD260]  245.45,39.28 270 bottom
LED205  [LD260]  241.95,39.28 270 bottom
LED206  [LD260]  231.58,39.28 270 bottom
LED301  [LD260]  182.35,39.28 270 bottom
LED302  [LD260]  199.85,39.28 270 bottom
LED303  [LD260]  196.35,39.28 270 bottom
LED304  [LD260]  192.85,39.28 270 bottom
LED305  [LD260]  189.35,39.28 270 bottom
LED306  [LD260]  178.98,39.28 270 bottom
LED401  [LD260]  129.75,39.28 270 bottom
LED402  [LD260]  147.25,39.28 270 bottom
LED403  [LD260]  143.75,39.28 270 bottom
LED404  [LD260]  140.25,39.28 270 bottom
LED405  [LD260]  136.75,39.28 270 bottom
LED406  [LD260]  126.38,39.28 270 bottom
LED501  [LD260]  77.15,39.28 270 bottom
LED502  [LD260]  94.65,39.28 270 bottom
LED503  [LD260]  91.15,39.28 270 bottom
LED504  [LD260]  87.65,39.28 270 bottom
LED505  [LD260]  84.15,39.28 270 bottom
LED506  [LD260]  73.78,39.28 270 bottom
LED601  [LD260]  24.55,39.28 270 bottom
LED602  [LD260]  42.05,39.28 270 bottom
LED603  [LD260]  38.55,39.28 270 bottom
LED604  [LD260]  35.05,39.28 270 bottom
LED605  [LD260]  31.55,39.28 270 bottom
LED606  [LD260]  21.18,39.28 270 bottom
LED701  [LD260]  287.55,135.28 270 bottom
LED702  [LD260]  305.05,135.28 270 bottom
LED703  [LD260]  301.55,135.28 270 bottom
LED704  [LD260]  298.05,135.28 270 bottom
LED705  [LD260]  294.55,135.28 270 bottom
LED706  [LD260]  284.18,135.28 270 bottom
LED801  [LD260]  234.95,135.28 270 bottom
LED802  [LD260]  252.45,135.28 270 bottom
LED803  [LD260]  248.95,135.28 270 bottom
LED804  [LD260]  245.45,135.28 270 bottom
LED805  [LD260]  241.95,135.28 270 bottom
LED806  [LD260]  231.58,135.28 270 bottom
LED901  [LD260]  182.35,135.28 270 bottom
LED902  [LD260]  199.85,135.28 270 bottom
LED903  [LD260]  196.35,135.28 270 bottom
LED904  [LD260]  192.85,135.28 270 bottom
LED905  [LD260]  189.35,135.28 270 bottom
LED906  [LD260]  178.98,135.28 270 bottom
LED1001  [LD260]  129.75,135.28 270 bottom
LED1002  [LD260]  147.25,135.28 270 bottom
LED1003  [LD260]  143.75,135.28 270 bottom
LED1004  [LD260]  140.25,135.28 270 bottom
LED1005  [LD260]  136.75,135.28 270 bottom
LED1006  [LD260]  126.38,135.28 270 bottom
LED1101  [LD260]  77.15,135.28 270 bottom
LED1102  [LD260]  94.65,135.28 270 bottom
LED1103  [LD260]  91.15,135.28 270 bottom
LED1104  [LD260]  87.65,135.28 270 bottom
LED1105  [LD260]  84.15,135.28 270 bottom
LED1106  [LD260]  73.78,135.28 270 bottom
LED1201  [LD260]  24.55,135.28 270 bottom
LED1202  [LD260]  42.05,135.28 270 bottom
LED1203  [LD260]  38.55,135.28 270 bottom
LED1204  [LD260]  35.05,135.28 270 bottom
LED1205  [LD260]  31.55,135.28 270 bottom
LED1206  [LD260]  21.18,135.28 270 bottom
Q101  BA.  [SOT89]  311.72,28.1 180 top
Q102  BA.  [SOT89]  311.47,15.15 180 top
Q103  MY  [SOT89]  299.4,66.46 270 top
Q104  BA  [SOT89]  293.43,93.76 180 top
Q105  BA  [SOT89]  271.59,49.18 180 top
Q106  J1  [SOT-23]  283.78,14.26 0 top
Q107  J1  [SOT-23]  297.12,79.28 0 top
Q201  BA.  [SOT89]  259.12,28.1 180 top
Q202  BA.  [SOT89]  258.87,15.15 180 top
Q203  MY  [SOT89]  246.8,66.46 270 top
Q204  BA  [SOT89]  240.83,93.76 180 top
Q205  BA  [SOT89]  218.99,49.18 180 top
Q206  J1  [SOT-23]  231.18,14.26 0 top
Q207  J1  [SOT-23]  244.51,79.28 0 top
Q301  BA.  [SOT89]  206.52,28.1 180 top
Q302  BA.  [SOT89]  206.27,15.15 180 top
Q303  MY  [SOT89]  194.2,66.46 270 top
Q304  BA  [SOT89]  188.23,93.76 180 top
Q305  BA  [SOT89]  166.39,49.18 180 top
Q306  J1  [SOT-23]  178.58,14.26 0 top
Q307  J1  [SOT-23]  191.91,79.28 0 top
Q401  BA.  [SOT89]  153.92,28.1 180 top
Q402  BA.  [SOT89]  153.67,15.15 180 top
Q403  MY  [SOT89]  141.6,66.46 270 top
Q404  BA  [SOT89]  135.63,93.76 180 top
Q405  BA  [SOT89]  113.79,49.18 180 top
Q406  J1  [SOT-23]  125.98,14.26 0 top
Q407  J1  [SOT-23]  139.31,79.28 0 top
Q501  BA.  [SOT89]  101.32,28.1 180 top
Q502  BA.  [SOT89]  101.07,15.15 180 top
Q503  MY  [SOT89]  89,66.46 270 top
Q504  BA  [SOT89]  83.03,93.76 180 top
Q505  BA  [SOT89]  61.19,49.18 180 top
Q506  J1  [SOT-23]  73.38,14.26 0 top
Q507  J1  [SOT-23]  86.72,79.28 0 top
Q601  BA.  [SOT89]  48.72,28.1 180 top
Q602  BA.  [SOT89]  48.47,15.15 180 top
Q603  MY  [SOT89]  36.4,66.46 270 top
Q604  BA  [SOT89]  30.43,93.76 180 top
Q605  BA  [SOT89]  8.59,49.18 180 top
Q606  J1  [SOT-23]  20.78,14.26 0 top
Q607  J1  [SOT-23]  34.12,79.28 0 top
Q701  BA.  [SOT89]  311.72,124.1 180 top
Q702  BA.  [SOT89]  311.47,111.15 180 top
Q703  MY  [SOT89]  299.4,162.46 270 top
Q704  BA  [SOT89]  293.43,189.76 180 top
Q705  BA  [SOT89]  271.59,145.18 180 top
Q706  J1  [SOT-23]  283.78,110.26 0 top
Q707  J1  [SOT-23]  297.12,175.28 0 top
Q801  BA.  [SOT89]  259.12,124.1 180 top
Q802  BA.  [SOT89]  258.87,111.15 180 top
Q803  MY  [SOT89]  246.8,162.46 270 top
Q804  BA  [SOT89]  240.83,189.76 180 top
Q805  BA  [SOT89]  218.99,145.18 180 top
Q806  J1  [SOT-23]  231.18,110.26 0 top
Q807  J1  [SOT-23]  244.51,175.28 0 top
Q901  BA.  [SOT89]  206.52,124.1 180 top
Q902  BA.  [SOT89]  206.27,111.15 180 top
Q903  MY  [SOT89]  194.2,162.46 270 top
Q904  BA  [SOT89]  188.23,189.76 180 top
Q905  BA  [SOT89]  166.39,145.18 180 top
Q906  J1  [SOT-23]  178.58,110.26 0 top
Q907  J1  [SOT-23]  191.91,175.28 0 top
Q1001  BA.  [SOT89]  153.92,124.1 180 top
Q1002  BA.  [SOT89]  153.67,111.15 180 top
Q1003  MY  [SOT89]  141.6,162.46 270 top
Q1004  BA  [SOT89]  135.63,189.76 180 top
Q1005  BA  [SOT89]  113.79,145.18 180 top
Q1006  J1  [SOT-23]  125.98,110.26 0 top
Q1007  J1  [SOT-23]  139.31,175.28 0 top
Q1101  BA.  [SOT89]  101.32,124.1 180 top
Q1102  BA.  [SOT89]  101.07,111.15 180 top
Q1103  MY  [SOT89]  89,162.46 270 top
Q1104  BA  [SOT89]  83.03,189.76 180 top
Q1105  BA  [SOT89]  61.19,145.18 180 top
Q1106  J1  [SOT-23]  73.38,110.26 0 top
Q1107  J1  [SOT-23]  86.72,175.28 0 top
Q1201  BA.  [SOT89]  48.72,124.1 180 top
Q1202  BA.  [SOT89]  48.47,111.15 180 top
Q1203  MY  [SOT89]  36.4,162.46 270 top
Q1204  BA  [SOT89]  30.43,189.76 180 top
Q1205  BA  [SOT89]  8.59,145.18 180 top
Q1206  J1  [SOT-23]  20.78,110.26 0 top
Q1207  J1  [SOT-23]  34.12,175.28 0 top
R101  102  [R0805]  306.77,8.16 0 top
R102  13  [R1206]  305.88,22.51 270 top
R103  R_user  [R0805']  301.81,12.87 270 top
R104  R_user  [R0805']  306,8.67 180 bottom
R105  4701  [R0805]  311.21,67.73 0 top
R106  13  [R1206]  301.56,18.96 270 top
R107  1002  [R0805]  311.21,72.3 180 top
R108  1002  [R0805]  305.12,77.89 0 top
R109  104.  [R0805]  272.1,95.03 180 top
R110  104.  [R0805]  275.4,95.03 180 top
R111  104.  [R0805]  278.7,95.03 180 top
R112  102  [R0805]  302.07,77.89 0 top
R113  102  [R0805]  305.12,67.47 180 top
R114  102  [R0805]  308.16,67.47 180 top
R115  100  [R0805]  300.8,57.31 90 top
R116  4701  [R0805]  299.02,71.28 0 top
R117  2702  [R0805]  299.02,75.35 180 top
R118  13  [R1206]  293.94,66.21 270 top
R119  2201  [R0805]  290.64,66.2 180 top
R120  1002  [R0805]  286.45,53.5 270 top
R121  1502  [R0805]  311.97,48.8 90 top
R122  2702  [R0805]  311.97,51.34 90 top
R123  2702  [R0805]  311.97,56.68 270 top
R124  1002  [R0805]  297.56,49.25 0 top
R125  104  [R0805]  295.34,47.85 0 top
R126  4701  [R0805]  291.27,54.52 90 top
R127  47  [V235/17_1MM]  296.99,97.95 0 bottom
R128  102  [R0805]  296.73,88.68 180 top
R129  47  [V235/17_1MM]  277.11,97.95 0 bottom
R130  104  [R0805]  295.34,52.55 0 top
R131  1502  [R0805]  303.34,45.5 270 top
R132  1002  [R0805]  302,42.83 270 top
R133  2201  [R0805]  297.43,42.83 90 top
R134  13  [R1206]  277.94,52.1 270 top
R135  104.  [R0805]  293.05,74.33 0 top
R136  47  [V235/17_1MM]  296.48,92.36 0 bottom
R137  47  [V235/17_1MM]  276.6,92.36 180 bottom
R138  100  [R0805]  293.69,78.78 180 top
R139  (101)  [R0805]  290.51,78.78 180 top
R140  2702  [R0805]  284.92,67.22 0 top
R141  104  [R0805]  279.97,78.14 0 top
R142  (1000)  [R0805]  306.64,42.83 90 top
R143  (101)  [R0805]  290.51,33.31 0 top
R144  (1002)  [R0805]  276.03,65.57 90 top
R145  2702  [R0805]  278.19,74.58 0 top
R146  (1002)  [R0805]  266.76,32.8 180 top
R201  102  [R0805]  254.17,8.16 0 top
R202  13  [R1206]  253.28,22.51 270 top
R203  R_user  [R0805']  249.21,12.87 270 top
R204  R_user  [R0805']  253.41,8.67 180 bottom
R205  4701  [R0805]  258.61,67.73 0 top
R206  13  [R1206]  248.96,18.96 270 top
R207  1002  [R0805]  258.61,72.3 180 top
R208  1002  [R0805]  252.52,77.89 0 top
R209  104.  [R0805]  219.5,95.03 180 top
R210  104.  [R0805]  222.8,95.03 180 top
R211  104.  [R0805]  226.1,95.03 180 top
R212  102  [R0805]  249.47,77.89 0 top
R213  102  [R0805]  252.52,67.47 180 top
R214  102  [R0805]  255.56,67.47 180 top
R215  100  [R0805]  248.2,57.31 90 top
R216  4701  [R0805]  246.42,71.28 0 top
R217  2702  [R0805]  246.42,75.35 180 top
R218  13  [R1206]  241.34,66.21 270 top
R219  2201  [R0805]  238.04,66.2 180 top
R220  1002  [R0805]  233.85,53.5 270 top
R221  1502  [R0805]  259.37,48.8 90 top
R222  2702  [R0805]  259.37,51.34 90 top
R223  2702  [R0805]  259.37,56.68 270 top
R224  1002  [R0805]  244.96,49.25 0 top
R225  104  [R0805]  242.74,47.85 0 top
R226  4701  [R0805]  238.67,54.52 90 top
R227  47  [V235/17_1MM]  244.39,97.95 0 bottom
R228  102  [R0805]  244.13,88.68 180 top
R229  47  [V235/17_1MM]  224.51,97.95 0 bottom
R230  104  [R0805]  242.74,52.55 0 top
R231  1502  [R0805]  250.74,45.5 270 top
R232  1002  [R0805]  249.4,42.83 270 top
R233  2201  [R0805]  244.83,42.83 90 top
R234  13  [R1206]  225.34,52.1 270 top
R235  104  [R0805]  240.45,74.33 0 top
R236  47  [V235/17_1MM]  243.88,92.36 0 bottom
R237  47  [V235/17_1MM]  224,92.36 180 bottom
R238  100  [R0805]  241.09,78.78 180 top
R239  (101)  [R0805]  237.91,78.78 180 top
R240  2702  [R0805]  232.32,67.22 0 top
R241  104  [R0805]  227.37,78.14 0 top
R242  (1000)  [R0805]  254.04,42.83 90 top
R243  (101)  [R0805]  237.91,33.31 0 top
R244  (1002)  [R0805]  223.43,65.57 90 top
R245  2702  [R0805]  225.59,74.58 0 top
R246  (1002)  [R0805]  214.16,32.8 180 top
R301  102  [R0805]  201.57,8.16 0 top
R302  13  [R1206]  200.68,22.51 270 top
R303  R_user  [R0805']  196.61,12.87 270 top
R304  R_user  [R0805']  200.81,8.67 180 bottom
R305  4701  [R0805]  206.01,67.73 0 top
R306  13  [R1206]  196.36,18.96 270 top
R307  1002  [R0805]  206.01,72.3 180 top
R308  1002  [R0805]  199.92,77.89 0 top
R309  104.  [R0805]  166.9,95.03 180 top
R310  104.  [R0805]  170.2,95.03 180 top
R311  104.  [R0805]  173.5,95.03 180 top
R312  102  [R0805]  196.87,77.89 0 top
R313  102  [R0805]  199.92,67.47 180 top
R314  102  [R0805]  202.96,67.47 180 top
R315  100  [R0805]  195.6,57.31 90 top
R316  4701  [R0805]  193.82,71.28 0 top
R317  2702  [R0805]  193.82,75.35 180 top
R318  13  [R1206]  188.74,66.21 270 top
R319  2201  [R0805]  185.44,66.2 180 top
R320  1002  [R0805]  181.25,53.5 270 top
R321  1502  [R0805]  206.77,48.8 90 top
R322  2702  [R0805]  206.77,51.34 90 top
R323  2702  [R0805]  206.77,56.68 270 top
R324  1002  [R0805]  192.36,49.25 0 top
R325  104  [R0805]  190.14,47.85 0 top
R326  4701  [R0805]  186.07,54.52 90 top
R327  47  [V235/17_1MM]  191.79,97.95 0 bottom
R328  102  [R0805]  191.53,88.68 180 top
R329  47  [V235/17_1MM]  171.91,97.95 0 bottom
R330  104  [R0805]  190.14,52.55 0 top
R331  1502  [R0805]  198.14,45.5 270 top
R332  1002  [R0805]  196.8,42.83 270 top
R333  2201  [R0805]  192.23,42.83 90 top
R334  13  [R1206]  172.74,52.1 270 top
R335  104.  [R0805]  187.85,74.33 0 top
R336  47  [V235/17_1MM]  191.28,92.36 0 bottom
R337  47  [V235/17_1MM]  171.4,92.36 180 bottom
R338  100  [R0805]  188.49,78.78 180 top
R339  (101)  [R0805]  185.31,78.78 180 top
R340  2702  [R0805]  179.72,67.22 0 top
R341  104  [R0805]  174.77,78.14 0 top
R342  (1000)  [R0805]  201.44,42.83 90 top
R343  (101)  [R0805]  185.31,33.31 0 top
R344  (1002)  [R0805]  170.83,65.57 90 top
R345  2702  [R0805]  172.99,74.58 0 top
R346  (1002)  [R0805]  161.56,32.8 180 top
R401  102  [R0805]  148.97,8.16 0 top
R402  13  [R1206]  148.08,22.51 270 top
R403  R_user  [R0805']  144.01,12.87 270 top
R404  R_user  [R0805']  148.21,8.67 180 bottom
R405  4701  [R0805]  153.41,67.73 0 top
R406  13  [R1206]  143.76,18.96 270 top
R407  1002  [R0805]  153.41,72.3 180 top
R408  1002  [R0805]  147.32,77.89 0 top
R409  104.  [R0805]  114.3,95.03 180 top
R410  104.  [R0805]  117.6,95.03 180 top
R411  104.  [R0805]  120.9,95.03 180 top
R412  102  [R0805]  144.27,77.89 0 top
R413  102  [R0805]  147.32,67.47 180 top
R414  102  [R0805]  150.36,67.47 180 top
R415  100  [R0805]  143,57.31 90 top
R416  4701  [R0805]  141.22,71.28 0 top
R417  2702  [R0805]  141.22,75.35 180 top
R418  13  [R1206]  136.14,66.21 270 top
R419  2201  [R0805]  132.84,66.2 180 top
R420  1002  [R0805]  128.65,53.5 270 top
R421  1502  [R0805]  154.17,48.8 90 top
R422  2702  [R0805]  154.17,51.34 90 top
R423  2702  [R0805]  154.17,56.68 270 top
R424  1002  [R0805]  139.76,49.25 0 top
R425  104  [R0805]  137.54,47.85 0 top
R426  4701  [R0805]  133.47,54.52 90 top
R427  47  [V235/17_1MM]  139.19,97.95 0 bottom
R428  102  [R0805]  138.93,88.68 180 top
R429  47  [V235/17_1MM]  119.31,97.95 0 bottom
R430  104  [R0805]  137.54,52.55 0 top
R431  1502  [R0805]  145.54,45.5 270 top
R432  1002  [R0805]  144.2,42.83 270 top
R433  2201  [R0805]  139.63,42.83 90 top
R434  13  [R1206]  120.14,52.1 270 top
R435  104  [R0805]  135.25,74.33 0 top
R436  47  [V235/17_1MM]  138.68,92.36 0 bottom
R437  47  [V235/17_1MM]  118.8,92.36 180 bottom
R438  100  [R0805]  135.89,78.78 180 top
R439  (101)  [R0805]  132.71,78.78 180 top
R440  2702  [R0805]  127.12,67.22 0 top
R441  104  [R0805]  122.17,78.14 0 top
R442  (1000)  [R0805]  148.84,42.83 90 top
R443  (101)  [R0805]  132.71,33.31 0 top
R444  (1002)  [R0805]  118.23,65.57 90 top
R445  2702  [R0805]  120.39,74.58 0 top
R446  (1002)  [R0805]  108.96,32.8 180 top
R501  102  [R0805]  96.37,8.16 0 top
R502  13  [R1206]  95.48,22.51 270 top
R503  R_user  [R0805']  91.41,12.87 270 top
R504  R_user  [R0805']  95.61,8.67 180 bottom
R505  4701  [R0805]  100.81,67.73 0 top
R506  13  [R1206]  91.16,18.96 270 top
R507  1002  [R0805]  100.81,72.3 180 top
R508  1002  [R0805]  94.72,77.89 0 top
R509  104.  [R0805]  61.7,95.03 180 top
R510  104.  [R0805]  65,95.03 180 top
R511  104.  [R0805]  68.3,95.03 180 top
R512  102  [R0805]  91.67,77.89 0 top
R513  102  [R0805]  94.72,67.47 180 top
R514  102  [R0805]  97.76,67.47 180 top
R515  100  [R0805]  90.4,57.31 90 top
R516  4701  [R0805]  88.62,71.28 0 top
R517  2702  [R0805]  88.62,75.35 180 top